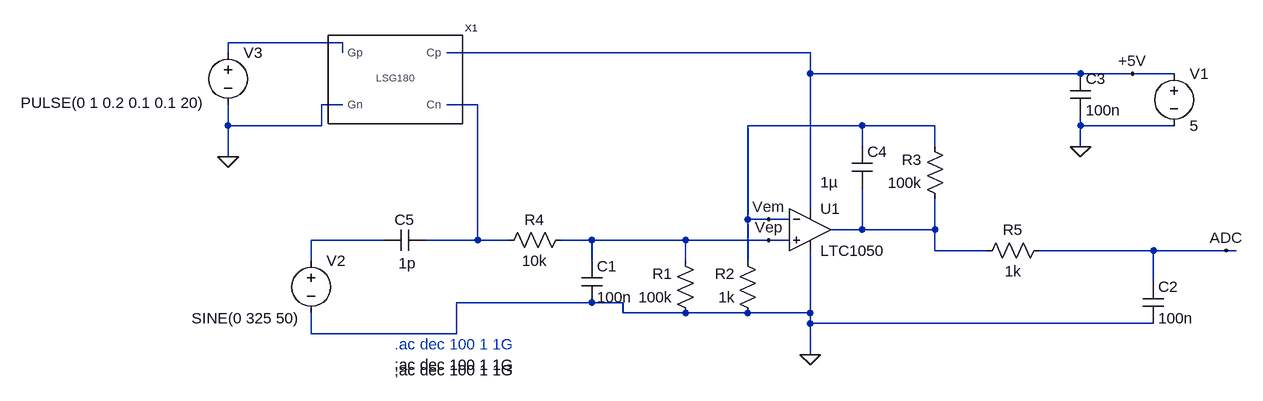
[diagram p0: schematic Amplificateur_transimpedance.asc]
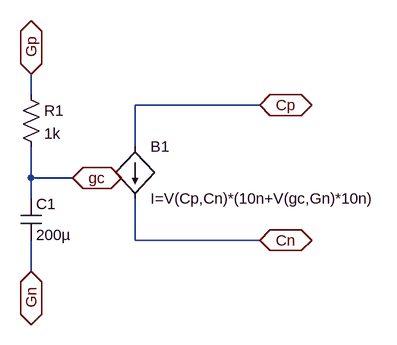
[diagram p1: sub-circuit capteur_graphite.asc]
Amplificateur_transimpedance.asc, the LTspice schematic file:
Version 4.1
SHEET 1 1000 680
WIRE -400 -384 -576 -384
WIRE -576 -368 -576 -384
WIRE -400 -368 -400 -384
WIRE 320 -368 -240 -368
WIRE 320 -336 320 -368
WIRE 736 -336 320 -336
WIRE 816 -336 736 -336
WIRE 880 -336 816 -336
WIRE -400 -288 -432 -288
WIRE -192 -288 -240 -288
WIRE -576 -256 -576 -288
WIRE -432 -256 -432 -288
WIRE -432 -256 -576 -256
WIRE 400 -256 224 -256
WIRE 512 -256 400 -256
WIRE 736 -256 736 -272
WIRE 880 -256 736 -256
WIRE 400 -224 400 -256
WIRE 512 -224 512 -256
WIRE 736 -224 736 -256
WIRE -576 -208 -576 -256
WIRE 320 -128 320 -336
WIRE 224 -112 224 -256
WIRE 256 -112 224 -112
WIRE 288 -112 256 -112
WIRE 400 -96 400 -160
WIRE 400 -96 352 -96
WIRE 512 -96 512 -144
WIRE 512 -96 400 -96
WIRE -336 -80 -448 -80
WIRE -192 -80 -192 -288
WIRE -192 -80 -272 -80
WIRE -144 -80 -192 -80
WIRE -16 -80 -64 -80
WIRE 128 -80 -16 -80
WIRE 256 -80 128 -80
WIRE 288 -80 256 -80
WIRE 512 -64 512 -96
WIRE 592 -64 512 -64
WIRE 848 -64 672 -64
WIRE 960 -64 848 -64
WIRE 976 -64 960 -64
WIRE -448 -48 -448 -80
WIRE -16 -48 -16 -80
WIRE 128 -48 128 -80
WIRE 224 -48 224 -112
WIRE 848 -16 848 -64
WIRE -16 16 -224 16
WIRE 32 16 -16 16
WIRE 32 32 32 16
WIRE 128 32 32 32
WIRE 224 32 128 32
WIRE 320 32 320 -64
WIRE 320 32 224 32
WIRE 320 48 320 32
WIRE 848 48 320 48
WIRE -448 64 -448 32
WIRE -224 64 -224 16
WIRE -224 64 -448 64
WIRE 320 96 320 48
FLAG 320 96 0
FLAG 736 -224 0
FLAG 256 -112 Vem
FLAG 256 -80 Vep
FLAG 960 -64 ADC
FLAG 816 -336 +5V
FLAG -576 -208 0
SYMBOL res 144 48 R180
WINDOW 0 36 76 Left 2
WINDOW 3 36 40 Left 2
SYMATTR InstName R1
SYMATTR Value 100k
SYMBOL res 240 48 R180
WINDOW 0 36 76 Left 2
WINDOW 3 36 40 Left 2
SYMATTR InstName R2
SYMATTR Value 1k
SYMBOL res 528 -128 R180
WINDOW 0 36 76 Left 2
WINDOW 3 36 40 Left 2
SYMATTR InstName R3
SYMATTR Value 100k
SYMBOL res -160 -64 R270
WINDOW 0 32 56 VTop 2
WINDOW 3 0 56 VBottom 2
SYMATTR InstName R4
SYMATTR Value 10k
SYMBOL res 688 -80 R90
WINDOW 0 0 56 VBottom 2
WINDOW 3 32 56 VTop 2
SYMATTR InstName R5
SYMATTR Value 1k
SYMBOL cap -32 -48 R0
SYMATTR InstName C1
SYMATTR Value 100n
SYMBOL cap 832 -16 R0
SYMATTR InstName C2
SYMATTR Value 100n
SYMBOL cap 720 -336 R0
SYMATTR InstName C3
SYMATTR Value 100n
SYMBOL cap 384 -224 R0
WINDOW 3 -48 55 Left 2
SYMATTR Value 1µ
SYMATTR InstName C4
SYMBOL voltage 880 -352 R0
WINDOW 123 0 0 Left 0
WINDOW 39 0 0 Left 0
SYMATTR InstName V1
SYMATTR Value 5
SYMBOL OpAmps\\LTC1050 320 -160 R0
SYMATTR InstName U1
SYMBOL Capteur_graphite -320 -320 R0
SYMATTR InstName X1
SYMBOL cap -272 -96 R90
WINDOW 0 0 32 VBottom 2
WINDOW 3 36 28 VTop 2
SYMATTR InstName C5
SYMATTR Value 1p
SYMBOL voltage -448 -64 R0
WINDOW 3 -184 104 Left 2
WINDOW 123 0 0 Left 0
WINDOW 39 0 0 Left 0
SYMATTR Value SINE(0 325 50)
SYMATTR InstName V2
SYMBOL voltage -576 -384 R0
WINDOW 3 -319 93 Left 2
WINDOW 123 0 0 Left 0
WINDOW 39 0 0 Left 0
SYMATTR Value PULSE(0 1 0.2 0.1 0.1 20)
SYMATTR InstName V3
TEXT -320 120 Left 2 !;ac dec 100 1 1G
TEXT -320 80 Left 2 ;.ac dec 100 1 1G
TEXT -320 112 Left 2 !;ac dec 100 1 1G

capteur_graphite.asc, the sub-circuit schematic file:
Version 4
SHEET 1 880 680
WIRE -80 32 -80 0
WIRE 272 48 80 48
WIRE 80 112 80 48
WIRE -80 160 -80 112
WIRE -16 160 -80 160
WIRE -80 192 -80 160
WIRE 80 256 80 192
WIRE 272 256 80 256
WIRE -80 304 -80 256
FLAG 272 48 Cp
IOPIN 272 48 BiDir
FLAG 272 256 Cn
IOPIN 272 256 BiDir
FLAG -16 160 gc
IOPIN -16 160 BiDir
FLAG -80 0 Gp
IOPIN -80 0 BiDir
FLAG -80 304 Gn
IOPIN -80 304 BiDir
SYMBOL bi 80 112 R0
SYMATTR InstName B1
SYMATTR Value I=V(Cp,Cn)*(10n+V(gc,Gn)*10n)
SYMBOL res -96 16 R0
SYMATTR InstName R1
SYMATTR Value 1k
SYMBOL cap -96 192 R0
SYMATTR InstName C1
SYMATTR Value 200µ

The netlist it stands for:
* Amplificateur_transimpedance.asc
R1 0 Vep 100k
R2 0 Vem 1k
R3 N003 Vem 100k
R4 N002 Vep 10k
R5 ADC N003 1k
C1 Vep 0 100n
C2 ADC 0 100n
C3 +5V 0 100n
C4 Vem N003 1µ
V1 +5V 0 5
X§U1 Vep Vem +5V 0 N003 LTC1050  ; pins In+ In- V+ V- OUT
X§X1 +5V N002 N001 0 capteur_graphite
C5 N002 N004 1p
V2 N004 0 SINE(0 325 50)
V3 N001 0 PULSE(0 1 0.2 0.1 0.1 20)

* block symbol definitions
.subckt capteur_graphite Cp Cn Gp Gn
B1 Cp Cn I=V(Cp,Cn)*(10n+V(gc,Gn)*10n)
R1 Gp gc 1k
C1 gc Gn 200µ
.ends capteur_graphite

;ac dec 100 1 1G
* .ac dec 100 1 1G
;ac dec 100 1 1G
.lib LTC.lib
.backanno
.end